# EAGLE design NT_SolarModule_filterfinder (EAGLE 9.2.0)
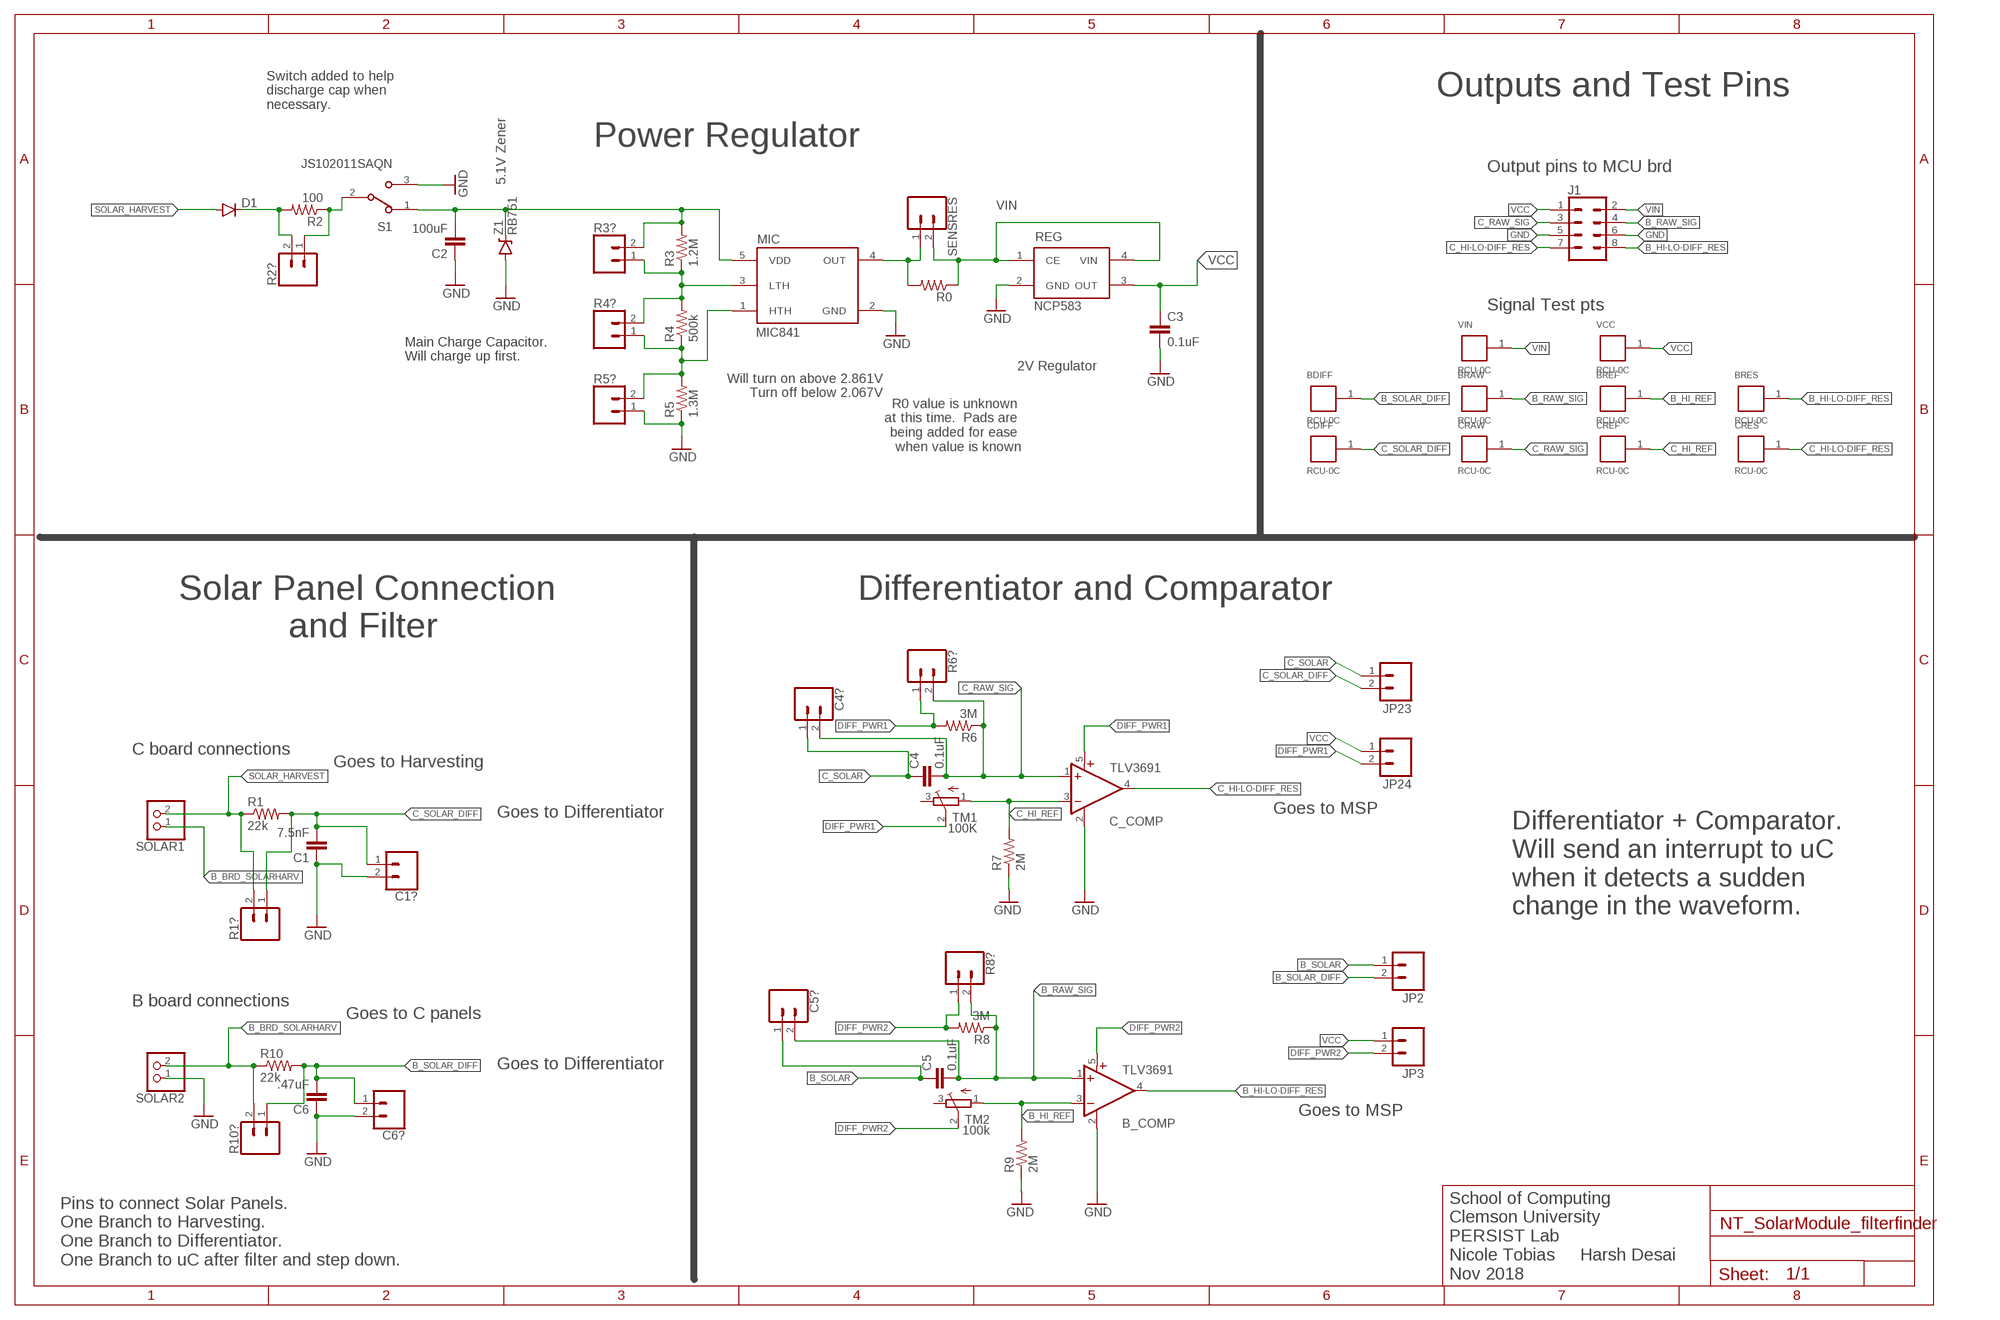
[diagram p0: schematic, sheet 1]

## Parts
B_COMP  TLV3691  [SC70-5]
BDIFF  RCU-0C  [TE_RCU-0C]
BRAW  RCU-0C  [TE_RCU-0C]
BREF  RCU-0C  [TE_RCU-0C]
BRES  RCU-0C  [TE_RCU-0C]
C1  7.5nF  CAP0603-CAP  [0603-CAP]
C1?  CONN_02  [1X02]
C2  100uF  CAP0603-CAP  [0603-CAP]
C3  0.1uF  CAP0603-CAP  [0603-CAP]
C4  0.1uF  CAP0603-CAP  [0603-CAP]
C4?  CONN_02  [1X02]
C5  0.1uF  CAP0603-CAP  [0603-CAP]
C5?  CONN_02  [1X02]
C6  .47uF  CAP0603-CAP  [0603-CAP]
C6?  CONN_02  [1X02]
C_COMP  TLV3691  [SC70-5]
CDIFF  RCU-0C  [TE_RCU-0C]
CRAW  RCU-0C  [TE_RCU-0C]
CREF  RCU-0C  [TE_RCU-0C]
CRES  RCU-0C  [TE_RCU-0C]
D1  DIODESOD523  [SOD523]
J1  CONN_04X2  [2X4]
JP2  M02  [1X02-1.27MM]
JP3  M02  [1X02-1.27MM]
JP23  M02  [1X02-1.27MM]
JP24  M02  [1X02-1.27MM]
MIC  MIC841  [SC70-5]
R0  RESISTOR0603  [0603-RES]
R1  22k  RESISTOR0603  [0603-RES]
R1?  CONN_02  [1X02]
R2  100  RESISTOR0603  [0603-RES]
R2?  CONN_02  [1X02]
R3  1.2M  RESISTOR0603  [0603-RES]
R3?  CONN_02  [1X02]
R4  500k  RESISTOR0603  [0603-RES]
R4?  CONN_02  [1X02]
R5  1.3M  RESISTOR0603  [0603-RES]
R5?  CONN_02  [1X02]
R6  3M  RESISTOR0603  [0603-RES]
R6?  CONN_02  [1X02]
R7  2M  RESISTOR0603  [0603-RES]
R8  3M  RESISTOR0603  [0603-RES]
R8?  CONN_02  [1X02]
R9  2M  RESISTOR0603  [0603-RES]
R10  22k  RESISTOR0603  [0603-RES]
R10?  CONN_02  [1X02]
REG  NCP583  [SC82-AB_1PRIMARY]
S1  JS102011SAQN  [SW_JS102011SAQN]
SENSRES  CONN_02  [1X02]
SOLAR1  PINHD-1X2  [1X02]
SOLAR2  PINHD-1X2  [1X02]
TM1  100K  TRIMPOTTC33X  [TC33X]
TM2  100k  TRIMPOTTC33X  [TC33X]
VCC  RCU-0C  [TE_RCU-0C]
VIN  RCU-0C  [TE_RCU-0C]
Z1  RB751  DIODE-ZENER  [SOD-523]

## Nets
B_BRD_SOLARHARV: R10.1 R10?.2 SOLAR1.1 SOLAR2.2
B_HI-LO-DIFF_RES: B_COMP.4(OUT) BRES.1 J1.8
B_HI_REF: B_COMP.3(-IN) BREF.1 R9.2 TM2.1(A)
B_RAW_SIG: B_COMP.1(+IN) BRAW.1 C5.2 C5?.2 J1.4 R8.1 R8?.2
B_SOLAR: C5.1 C5?.1 JP2.1
B_SOLAR_DIFF: BDIFF.1 C6.2 C6?.1 JP2.2 R10.2 R10?.1
C_HI-LO-DIFF_RES: C_COMP.4(OUT) CRES.1 J1.7
C_HI_REF: C_COMP.3(-IN) CREF.1 R7.2 TM1.1(A)
C_RAW_SIG: C4.2 C4?.2 C_COMP.1(+IN) CRAW.1 J1.3 R6.1 R6?.2
C_SOLAR: C4.1 C4?.1 JP23.1
C_SOLAR_DIFF: C1.2 C1?.1 CDIFF.1 JP23.2 R1.2 R1?.1
DIFF_PWR1: C_COMP.5(V+) JP24.2 R6.2 R6?.1 TM1.2(S)
DIFF_PWR2: B_COMP.5(V+) JP3.2 R8.2 R8?.1 TM2.2(S)
GND: B_COMP.2(GND) C1.1 C1?.2 C2.1 C3.2 C6.1 C6?.2 C_COMP.2(GND) J1.5 J1.6 MIC.2(GND) R5.1 R5?.1 R7.1 R9.1 REG.2(GND) S1.3 SOLAR2.1 Z1.ANODE(A)
MIC_INPUT: C2.2 MIC.5(VDD) R3.2 R3?.2 S1.1 Z1.CATHODE(C)
N$1: D1.C R2.2 R2?.2
N$3: MIC.4(OUT) R0.2 SENSRES.1
N$6: R2.1 R2?.1 S1.2
N$11: MIC.3(LTH) R3.1 R3?.1 R4.2 R4?.2
N$12: MIC.1(HTH) R4.1 R4?.1 R5.2 R5?.2
SOLAR_HARVEST: D1.A R1.1 R1?.2 SOLAR1.2
VCC: C3.1 J1.1 JP3.1 JP24.1 REG.3(OUT) VCC.1
VIN: J1.2 R0.1 REG.1(CE) REG.4(VIN) SENSRES.2 VIN.1
Unconnected: TM1.3(E) TM2.3(E)

## Notes on the sheet
- Outputs and Test Pins
- Switch added to help 
  discharge cap when 
  necessary.
- Power Regulator
- Output pins to MCU brd
- 5.1V Zener
- Signal Test pts
- Main Charge Capacitor.
  Will charge up first.
- 2V Regulator
- Will turn on above 2.861V
  Turn off below 2.067V
- R0 value is unknown 
  at this time.  Pads are 
  being added for ease 
  when value is known
- Differentiator and Comparator
- Solar Panel Connection
             and Filter
- C board connections
- Goes to Harvesting
- Goes to Differentiator | Goes to MSP
- Differentiator + Comparator.
  Will send an interrupt to uC 
  when it detects a sudden 
  change in the waveform.
- B board connections
- Goes to C panels
- Goes to Differentiator
- Goes to MSP
- Pins to connect Solar Panels.
  One Branch to Harvesting.
  One Branch to Differentiator.
  One Branch to uC after filter and step down.
- School of Computing
  Clemson University
  PERSIST Lab
  Nicole Tobias     Harsh Desai
  Nov 2018

## Library data of the parts
B_COMP C_COMP = fedpower:TLV3691: 0.9-V to 6.5-V, Nanopower Comparator Datasheets Analog Signal Chain Guide <http://www.ti.com/lit/pdf/slyb174> TLV3691 <http://www.ti.com/lit/ds/symlink/tlv3691.pdf> Manufacturer Product Page TLV3691IDPFR Specifications <http://www.ti.com/general/docs/suppproductinfo.tsp?distId=10&orderablePartNumber=TLV3691IDPFR> Standard Package <javascript:dlgHelp('Standard%20Packaging%20Help');> 1 Category Integrated Circuits (ICs) </product-search/en/integrated-circuits-ics> Family Linear - Comparators </product-search/en/integrated-circuits-ics/linear-comparators/2556221> Series - Packaging <javascript:dlgHelp('Standard%20Packaging%20Help');> Cut Tape (CT) <javascript:dlgHelp('Cut%20Tape%20Help');> Type General Purpose Number of Elements 1 Output Type Push-Pull Voltage - Supply, Single/Dual (±) 0.9 V ~ 6.5 V, ±0.45 V ~ 3.25 V Voltage - Input Offset (Max) 3mV Current - Input Bias (Max) 100pA Current - Output (Typ) 42mA Current - Quiescent (Max) 150nA CMRR, PSRR (Typ) - Propagation Delay (Max) 35µs Hysteresis - Operating Temperature -40°C ~ 125°C Package / Case 6-XFDFN Mounting Type Surface Mount Supplier Device Package 6-X2SON (1x1) Online Catalog Comparators - 1 element </catalog/en/partgroup/comparators-1-element/3112?mpart=TLV3691IDPFR&vendor=296&WT.z_ref_page_type=PS&WT.z_ref_page_sub_type=PD&WT.z_ref_page_id=PD&WT.z_ref_page_event=DC_Link_Table> Other Names 296-37242-1
BDIFF BRAW BREF BRES CDIFF CRAW CREF CRES VCC VIN = RCU-0C:RCU-0C: 0603 PROBE PAD; AVAILABILITY: Unavailable; COMMENT: RCU-0C _1625854-3_; DESCRIPTION: 0603 PROBE PAD; EU_ROHS_COMPLIANCE: Compliant; LINK: http://www.te.com/usa-en/product-1625854-3.html; MF: TE Connectivity; MP: RCU-0C; PACKAGE: 0603; POWER_RATING: 0 W; PRICE: None; RESISTANCE: <.05; TOLERANCE: 0%
C1-C6 = SparkFun-Capacitors:CAP: Capacitor Standard 0603 ceramic capacitor, and 0.1" leaded capacitor.
C1? C4? C5? C6? R1? R2? R3? R4? R5? R6? R8? R10? SENSRES = SparkFun-Connectors:CONN_02: Multi connection point. Often used as Generic Header-pin footprint for 0.1 inch spaced/style header connections On any of the 0.1 inch spaced packages, you can populate with these: Break Away Headers - Straight <https://www.sparkfun.com/products/116> (PRT-00116) Break Away Male Headers - Right Angle <https://www.sparkfun.com/products/553> (PRT-00553) Female Headers <https://www.sparkfun.com/products/115> (PRT-00115) Break Away Headers - Machine Pin <https://www.sparkfun.com/products/117> (PRT-00117) Break Away Female Headers - Swiss Machine Pin <https://www.sparkfun.com/products/743> (PRT-00743) For SCREWTERMINALS and SPRING TERMINALS visit here: Screw Terimnals on SparkFun.com <https://www.sparkfun.com/search/results?term=Screw+Terminals> (5mm/3.5mm/2.54mm spacing) This device is also useful as a general connection point to wire up your design to another part of your project. Our various solder wires solder well into these plated through hole pads. Hook-Up Wire - Assortment (Stranded, 22 AWG) <https://www.sparkfun.com/products/11375> (PRT-11375) Hook-Up Wire - Assortment (Solid Core, 22 AWG) <https://www.sparkfun.com/products/11367> (PRT-11367) View the entire wire category on our website here <https://www.sparkfun.com/categories/141> Special notes: Molex polarized connector foot print use with: PRT-08233 with associated crimp pins and housings. 2.54_SCREWTERM for use with PRT-10571. 3.5mm Screw Terminal footprints for PRT-08084 5mm Screw Terminal footprints for use with PRT-08432
D1 = SparkFun-DiscreteSemi:DIODE: Diode These are standard reverse protection diodes and small signal diodes. SMA package can handle up to about 1A. SOD-323 can handle about 200mA. What the SOD-323 package when ordering, there are some mfgs out there that are 5-pin packages.
J1 = SparkFun-Connectors:CONN_04X2: Multi connection point. Often used as Generic Header-pin footprint for 0.1 inch spaced/style header connections On any of the 0.1 inch spaced packages, you can populate with these: Break Away Headers - Straight <https://www.sparkfun.com/products/116> (PRT-00116) Break Away Male Headers - Right Angle <https://www.sparkfun.com/products/553> (PRT-00553) Female Headers <https://www.sparkfun.com/products/115> (PRT-00115) Break Away Headers - Machine Pin <https://www.sparkfun.com/products/117> (PRT-00117) Break Away Female Headers - Swiss Machine Pin <https://www.sparkfun.com/products/743> (PRT-00743)
JP2 JP3 JP23 JP24 = SparkFun-Connectors:M02: Standard 2-pin 0.1" header. Use with - straight break away headers ( PRT-00116) - right angle break away headers (PRT-00553) - swiss pins (PRT-00743) - machine pins (PRT-00117) - female headers (PRT-00115) Molex polarized connector foot print use with: PRT-08233 with associated crimp pins and housings. 2.54_SCREWTERM for use with PRT-10571. 3.5mm Screw Terminal footprints for PRT-08084 5mm Screw Terminal footprints for use with PRT-08432
MIC = mic841:MIC841: MIC841:Comparator with reference and adj. hysteresis
R0 R1-R10 = SparkFun-Resistors:RESISTOR: Resistor Basic schematic elements and footprints for 0603, 1206, and PTH resistors.
REG = ncp583:NCP583: NCP583 - Ultra-Low Iq 150 mA CMOS LDO Regulator with Enable The NCP583 series of low dropout regulators are designed for portable battery powered applications which require precise output voltage accuracy and low quiescent current. These devices feature an enable function which lowers current consumption significantly and are offered in two small packages; SC−82AB and the SOT−563. A 1.0 mF ceramic capacitor is the recommended value to be used with these devices on the output pin.
S1 = JS102011SAQN:JS102011SAQN: JS10 Series SPDT On-On 6 V 0.3 A Gull Wing SMT Slide Switch http://www.snapeda.com/parts/JS102011SAQN/C%26K%20Components/view-part/; AVAILABILITY: Good; DESCRIPTION: SWITCH SLIDE SPDT 300MA 6V; MF: C&K Components; MP: JS102011SAQN; PACKAGE: None; PRICE: 0.35 USD
SOLAR1 SOLAR2 = pinhead:PINHD-1X2: PIN HEADER
TM1 TM2 = adafruit:TRIMPOT: SMT trimmer potentiometer part number TC33X http://www.ladyada.net/library/eagle
Z1 = Parts:DIODE-ZENER: Zener Diode Production Part - 8199 3.4V Zener Voltage

## Board
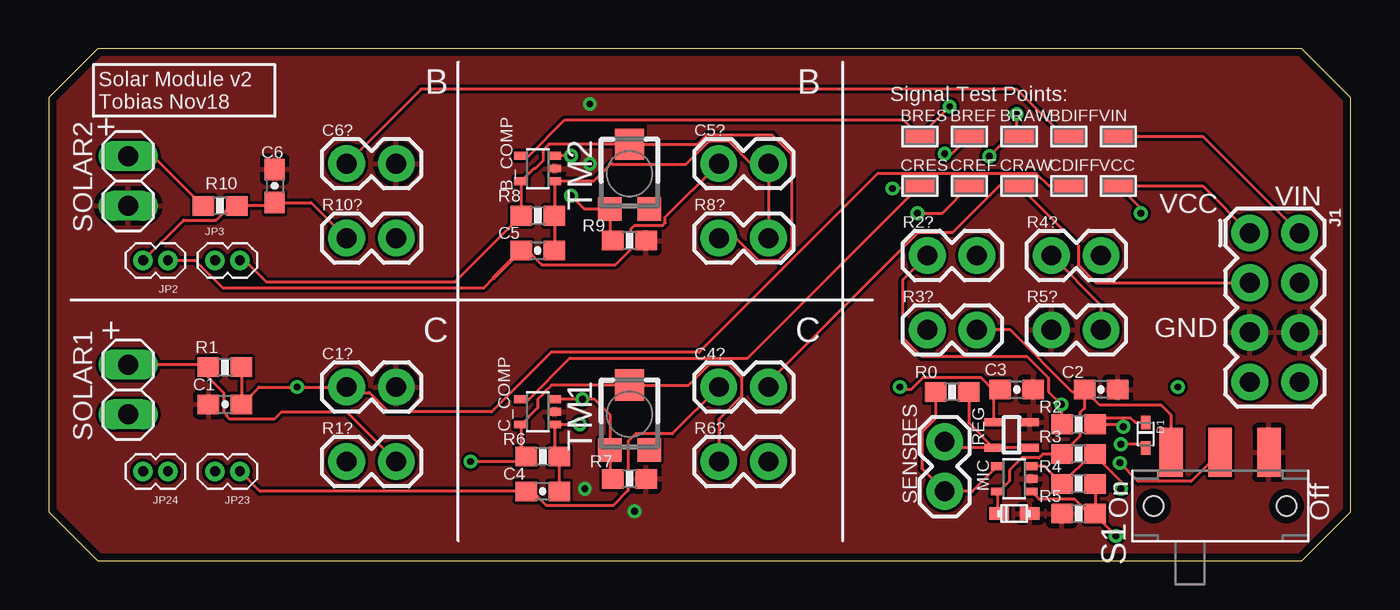
[diagram p1: board, top side]
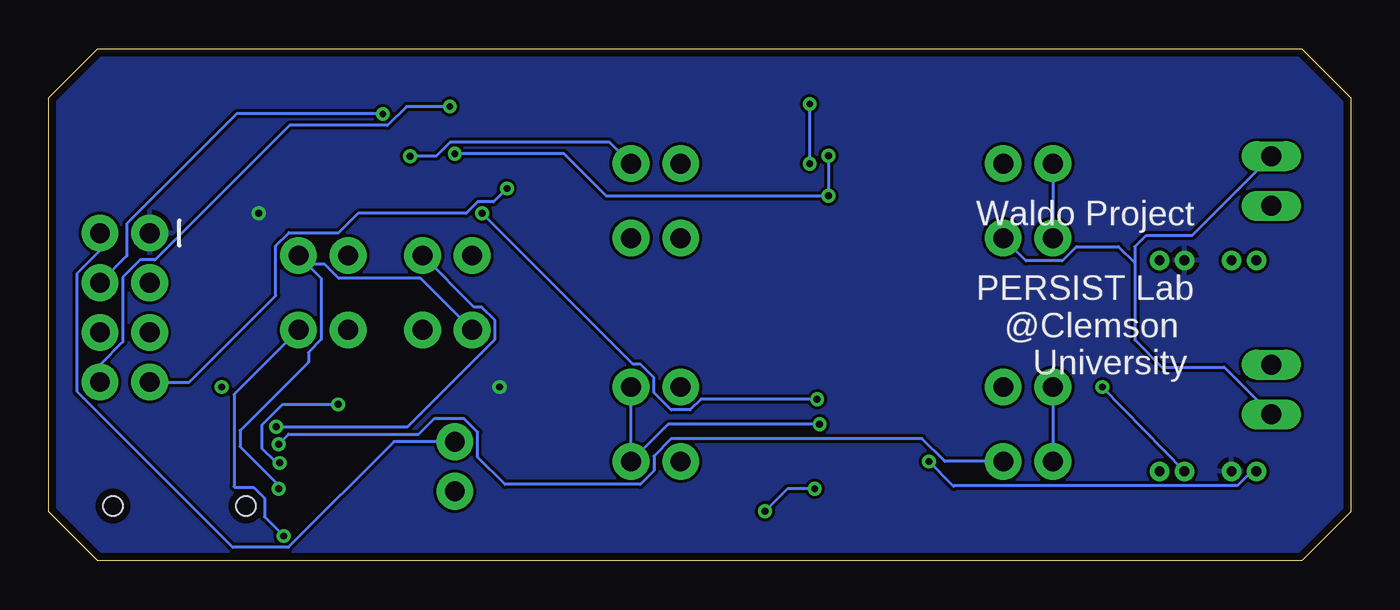
[diagram p2: board, bottom side, seen from below]

Size 66.62 x 26.19 mm. Coordinates in mm from the lower left corner, seen from the top.
Outline: 2.5,0 64.12,0 66.62,2.5 66.62,23.69 64.12,26.19 2.5,26.19 0,23.69 0,2.5 2.5,0
Copper layers (1*16): Top 0.0356mm / dielectric 1.5011mm / Bottom 0.0356mm
Design rules "oshpark-2layer *": minimum track width 6mil, minimum drill 13mil, track to track 6mil, track to pad 6mil, pad to pad 6mil, via to via 6mil, smd to smd 6mil, copper to edge 15mil, drill to drill 6mil, minimum pad ring 7mil, minimum via ring 7mil, stop-mask expansion 2.5mil, vias tented up to drill 14mil, thermal gap 10mil

### Footprints (pad centres in the part's own frame; a part is rotated, then mirrored left to right if it is on the bottom)
SC70-5 = smd 0.4 x 0.7: 1 -0.65,-0.85; 2 0,-0.85; 3 0.65,-0.85; 4 0.65,0.85; 5 -0.65,0.85
TE_RCU-0C = smd 1.6 x 0.8: 1 0,0
0603-CAP = smd 1.1 x 1: 1 -0.85,0; 2 0.85,0
1X02 = drill 1.016 pad 1.88: 1 0,0; 2 2.54,0
SOD523 = smd 0.7 x 0.5: A 0.7,0; C -0.6,0
2X4 = drill 1.016 pad 1.88: 1 -3.81,-1.27; 2 -3.81,1.27; 3 -1.27,-1.27; 4 -1.27,1.27; 5 1.27,-1.27; 6 1.27,1.27; 7 3.81,-1.27; 8 3.81,1.27
1X02-1.27MM = drill 0.508 pad 1: 1 0,0; 2 1.27,0
0603-RES = smd 1.1 x 1: 1 -0.85,0; 2 0.85,0
SC82-AB_1PRIMARY = smd 0.406 x 0.914: 1 -1.321,-0.813; 2 -0.025,-0.813; 3 -0.025,1.067; 4 -1.321,1.067
SW_JS102011SAQN = smd 1.2 x 2.5: 1 -2.5,2.75; 2 0,2.75; 3 2.5,2.75 | hole 1: -3.4,0; 3.4,0
1X02' = drill 1.016 long: 1 -1.27,0; 2 1.27,0
TC33X = smd 1.2 x 1.2: 1 -1,-1.825; 3 1,-1.825 | smd 1.5 x 1.6: 2 0,1.5
SOD-523 = smd 1 x 0.635: ANODE -0.8,0; CATHODE 0.76,0

### Placement (x,y rotation side)
B_COMP  25.02,20.07 90 top
BDIFF  52.2,21.72 0 top
BRAW  49.66,21.72 0 top
BREF  47.12,21.72 0 top
BRES  44.58,21.72 0 top
C1  9.02,8 0 top
C1?  15.24,8.89 0 top
C2  53.85,8.76 180 top
C3  49.53,8.76 0 top
C4  25.27,3.56 0 top
C4?  34.29,8.89 0 top
C5  25.02,15.87 0 top
C5?  34.29,20.32 0 top
C6  11.56,19.18 270 top
C6?  15.24,20.32 0 top
C_COMP  25.02,7.62 90 top
CDIFF  52.2,19.18 0 top
CRAW  49.66,19.18 0 top
CREF  47.12,19.18 0 top
CRES  44.58,19.18 0 top
D1  56.13,6.48 270 top
J1  62.74,12.95 270 top
JP2  6.1,15.37 180 top
JP3  8.51,15.37 0 top
JP23  9.78,4.57 180 top
JP24  6.1,4.57 180 top
MIC  49.4,4.19 90 top
R0  46.23,8.64 180 top
R1  9.02,9.91 0 top
R1?  15.24,5.08 0 top
R2  52.7,6.98 0 top
R2?  44.96,15.62 0 top
R3  52.7,5.46 180 top
R3?  44.96,11.81 0 top
R4  52.7,3.94 180 top
R4?  51.31,15.62 0 top
R5  52.7,2.41 0 top
R5?  51.31,11.81 0 top
R6  25.27,5.33 180 top
R6?  34.29,5.08 0 top
R7  29.72,4.19 180 top
R8  25.02,17.65 180 top
R8?  34.29,16.51 0 top
R9  29.72,16.38 180 top
R10  8.76,18.16 0 top
R10?  15.24,16.51 0 top
REG  49.4,7.11 90 top
S1  59.94,2.79 0 top
SENSRES  45.85,3.56 90 top
SOLAR1  [1X02']  4.06,8.76 90 top
SOLAR2  [1X02']  4.06,19.43 90 top
TM1  29.72,7.49 0 top
TM2  29.72,19.81 0 top
VCC  54.74,19.18 0 top
VIN  54.74,21.72 0 top
Z1  49.4,2.41 180 top

### Tracks (layer width: path | path; a pad name or v marks a point on that pad's centre or on a via)
B_BRD_SOLARHARV
  Top 0.152: SOLAR2.2 5.33,20.7 7.87,18.16 R10.1
  Bottom 0.152: 11.05,15.24 11.05,16.07 10.47,16.65 8.12,16.65 SOLAR2.2 | 11.05,15.24 11.05,11.3 9.65,9.91 6.48,9.91 SOLAR1.1 | R10?.2 16.61,15.34 14.76,15.34 14.03,16.07 11.88,16.07 11.05,15.24
B_HI-LO-DIFF_RES  (via drill 0.35)
  Top 0.152: B_COMP.4 24.57,20.72 26.4,22.55 43.74,22.55 BRES.1 v46.1,23.24
  Bottom 0.152: v46.1,23.24 48.33,23.24 49.29,22.28 54.3,22.28 61.19,15.39 61.95,15.39 62.84,14.51 62.84,11.2 64.01,10.03 J1.8
B_HI_REF  (via drill 0.35)
  Top 0.152: v26.72,20.72 B_COMP.3 | v26.72,18.67 27.41,17.99 TM2.1 28.72,16.53 R9.2 | BREF.1 46.23,20.83 v45.85,20.83
  Bottom 0.152: v26.72,20.72 v26.72,18.67 38.1,18.67 40.26,20.83 v45.85,20.83
B_RAW_SIG  (via drill 0.35)
  Top 0.152: C5.2 R8.1 B_COMP.1 27.87,19.42 28.77,20.32 28.84,20.32 28.87,20.28 32.6,20.28 33.81,21.49 34.77,21.49 35.94,20.32 C5?.2 R8?.2 | v48.13,20.7 49.15,21.72 BRAW.1 49.53,21.84 v49.53,22.86
  Bottom 0.152: v48.13,20.7 46.8,20.7 46.09,21.41 37.92,21.41 C5?.2 | J1.4 62.64,15.6 62.64,17.25 57.02,22.86 v49.53,22.86
B_SOLAR
  Top 0.152: JP2.1 7.49,15.37 7.78,15.08 7.78,15.06 8.21,14.64 8.22,14.64 8.89,13.97 22.26,13.97 22.76,14.47 | C5?.1 31.55,17.58 31.55,17.29 31.41,17.16 29.97,17.16 29.79,16.98 29.79,15.93 29,15.15 25.22,15.15 24.5,15.87 C5.1
  Top 0.203: 22.76,14.47 C5.1
B_SOLAR_DIFF
  Top 0.152: BDIFF.1 51.94,21.72 49.53,24.13 19.05,24.13 C6?.1 | JP2.2 6.89,17.43 8.56,17.43 9.37,18.24 9.7,18.24 R10.2 11.39,18.16 C6.2 13.42,18.33 R10?.1
  Bottom 0.152: C6?.1 R10?.1
C_HI-LO-DIFF_RES  (via drill 0.35)
  Top 0.152: C_COMP.4 24.57,8.27 26.66,10.36 35.76,10.36 CRES.1 44.45,19.05 v43.18,19.05
  Bottom 0.152: J1.7 59.44,9.14 55.02,13.56 55.02,16.11 54.33,16.79 51.79,16.79 50.8,17.78 45.27,17.78 44.69,18.36 43.87,18.36 v43.18,19.05
C_HI_REF  (via drill 0.35)
  Top 0.152: R7.2 28.72,4.34 TM1.1 28.72,7.48 27.93,8.27 v27.3,8.27 C_COMP.3 | v44.45,17.78 45.72,17.78 CREF.1
  Bottom 0.152: v27.3,8.27 33.26,8.27 33.81,7.72 34.77,7.72 35.66,8.61 35.66,9.37 36.35,10.06 36.73,10.06 v44.45,17.78
C_RAW_SIG  (via drill 0.35)
  Top 0.152: C4.2 R6.1 25.87,5.64 C_COMP.1 27.16,6.97 v27.18,6.98 | C4?.2 36.83,9.14 44.47,16.79 46.25,16.79 48.64,19.18 CRAW.1 52.68,16.15 52.68,15.14 53.59,14.22 J1.3
  Bottom 0.152: v27.18,6.98 34.92,6.98 R6?.2 C4?.2
C_SOLAR
  Top 0.152: JP23.1 10.79,3.56 C4.1 24.75,3.56 25.48,2.83 28.88,2.83 29.65,3.6 29.65,6.12 30.02,6.5 31.9,6.5 C4?.1
C_SOLAR_DIFF  (via drill 0.35)
  Top 0.152: CDIFF.1 51.18,19.18 50.55,19.81 42.41,19.81 33.27,10.67 25.69,10.67 22.65,7.62 17.4,7.62 16.41,8.61 15.52,8.61 C1?.1 v12.7,8.89 10.76,8.89 C1.2 R1.2
  Bottom 0.152: v12.7,8.89 JP23.2 | C1?.1 R1?.1
DIFF_PWR1  (via drill 0.35)
  Top 0.152: v21.59,5.08 24.17,5.08 R6.2 24.17,5.59 C_COMP.5 25.02,7.82 25.02,8.25 25.29,8.53 25.29,8.56 25.72,8.99 TM1.2 32.74,8.99 33.81,10.06 34.77,10.06 35.46,9.37 35.46,8.41 34.29,7.24 R6?.1
  Bottom 0.152: JP24.2 5.07,4.57 5.79,3.84 20.29,3.84 20.32,3.81 v21.59,5.08
DIFF_PWR2
  Top 0.152: JP3.2 10.03,15.37 11.12,14.28 20.79,14.28 R8.2 B_COMP.5 24.82,20.07 24.89,20.07 25.29,20.46 25.29,21.01 25.59,21.31 TM2.2 33.2,21.31 33.68,21.79 37.01,21.79 38,20.8 38,16.03 37.31,15.34 36.35,15.34 35.18,16.51 R8?.1
GND  (via drill 0.35)
  Bottom 0.152: v27.43,3.68 28.83,3.68 v29.97,2.54 | v27.69,23.37 v27.69,20.32
  pour Top: -2.54,29.21 69.85,29.21 69.85,-2.79 -2.54,-2.79
MIC_INPUT
  Top 0.152: Z1.CATHODE 48.55,2.5 MIC.5 48.59,3.5 49.17,4.08 49.17,4.63 49.81,5.27 50.68,5.27 50.87,5.46 R3.2 52.78,6.38 52.78,7.58 53,7.8 C2.2 53.1,8.66 | 53.1,8.66 53.79,7.97 56.92,7.97 57.44,7.45 S1.1 | R3?.2 49.22,11.81 52.37,8.66 53.1,8.66
N$1  (via drill 0.35)
  Top 0.152: D1.C 55.59,7.08 55.36,7.31 53.88,7.31 R2.2 54.86,6.98 v54.99,6.86
  Bottom 0.152: v54.99,6.86 48.26,6.86 44.48,10.64 44.47,10.64 43.79,11.33 43.79,12.29 44.47,12.98 44.86,12.98 R2?.2
N$3
  Top 0.152: R0.2 45.38,7.28 44.68,6.58 44.68,4.72 SENSRES.1 47.27,3.56 MIC.4
N$5  (via drill 0.35)
  other vias: 57.78,8.89
N$6  (via drill 0.35)
  Top 0.152: S1.2 58.47,4.06 55.73,4.06 v54.81,5.01 | R2?.1 43.69,14.35 43.69,11.43 44.67,10.44 50.07,10.44 51.16,9.36 51.16,8.66 v51.82,8 51.85,7.96 R2.1
  Bottom 0.152: v54.81,5.01 55.11,5.13 55.7,5.73 55.7,6.97 54.67,8 v51.82,8
N$11  (via drill 0.35)
  Top 0.152: MIC.3 50.95,4.84 R4.2 53.38,5.46 R3.1 53.55,5.37 54.86,4.06 v54.86,3.68
  Bottom 0.152: R4?.2 53.4,15.18 | 53.4,15.18 52.68,14.45 52.68,11.33 53.34,10.67 53.34,10.16 56.84,6.65 56.84,5.84 54.86,3.86 v54.86,3.68 | R3?.1 47.6,14.45 51.79,14.45 52.52,15.18 53.4,15.18
N$12  (via drill 0.35)
  Top 0.152: MIC.1 50.27,3.56 50.68,3.14 52.5,3.14 53.23,2.41 R5.2 | R4.1 R5.2 | R5.2 53.55,2.32 v54.61,1.27 | R4?.1 53.85,13.08 R5?.2
  Bottom 0.152: R5?.2 57.15,8.51 57.15,3.81 57.09,3.75 56.15,3.75 55.59,3.19 55.59,2.25 v54.61,1.27
SOLAR_HARVEST  (via drill 0.35)
  Top 0.152: SOLAR1.2 8.04,10.03 R1.1 8.17,9.37 8.95,8.6 8.95,7.62 9.09,7.48 9.09,7.41 9.22,7.27 11.56,7.27 11.91,7.62 15.24,7.62 R1?.2 | D1.A 55.94,5.97 v54.86,5.97
  Bottom 0.152: R1?.2 20.77,5.08 21.94,6.25 34.77,6.25 35.66,5.36 35.66,4.6 36.35,3.91 43.28,3.91 44.68,5.31 44.68,6.58 45.36,7.26 46.91,7.26 47.7,6.48 54.36,6.48 v54.86,5.97
VCC  (via drill 0.35)
  Top 0.152: REG.3 48.34,8.36 C3.1 48.32,8.76 47.72,9.37 44.73,9.37 44.13,8.76 43.69,8.76 v43.56,8.89 | J1.1 59.05,19.18 VCC.1 55.88,18.03 v55.88,17.78
  pour Bottom: -3.81,27.94 100.33,27.94 100.33,-7.62 -3.81,-7.62
VIN
  Top 0.152: REG.1 REG.4 | R0.1 47.08,7.05 REG.4 | REG.4 46.15,5.79 SENSRES.2 | VIN.1 59.05,21.72 J1.2
  Bottom 0.152: SENSRES.2 48.96,6.1 54.37,0.69 57.2,0.69 65.18,8.66 65.18,14.71 64.01,15.88 J1.2

### Text on the board
tPlace: B | B | Solar Module v2 / Tobias Nov18 | Signal Test Points: | + | VCC | VIN | C | C | GND | + | On | Off
bPlace: Waldo Project / / PERSIST Lab / @Clemson / University